# EAGLE design Jacdac_Proto_Board (EAGLE 9.6.2)
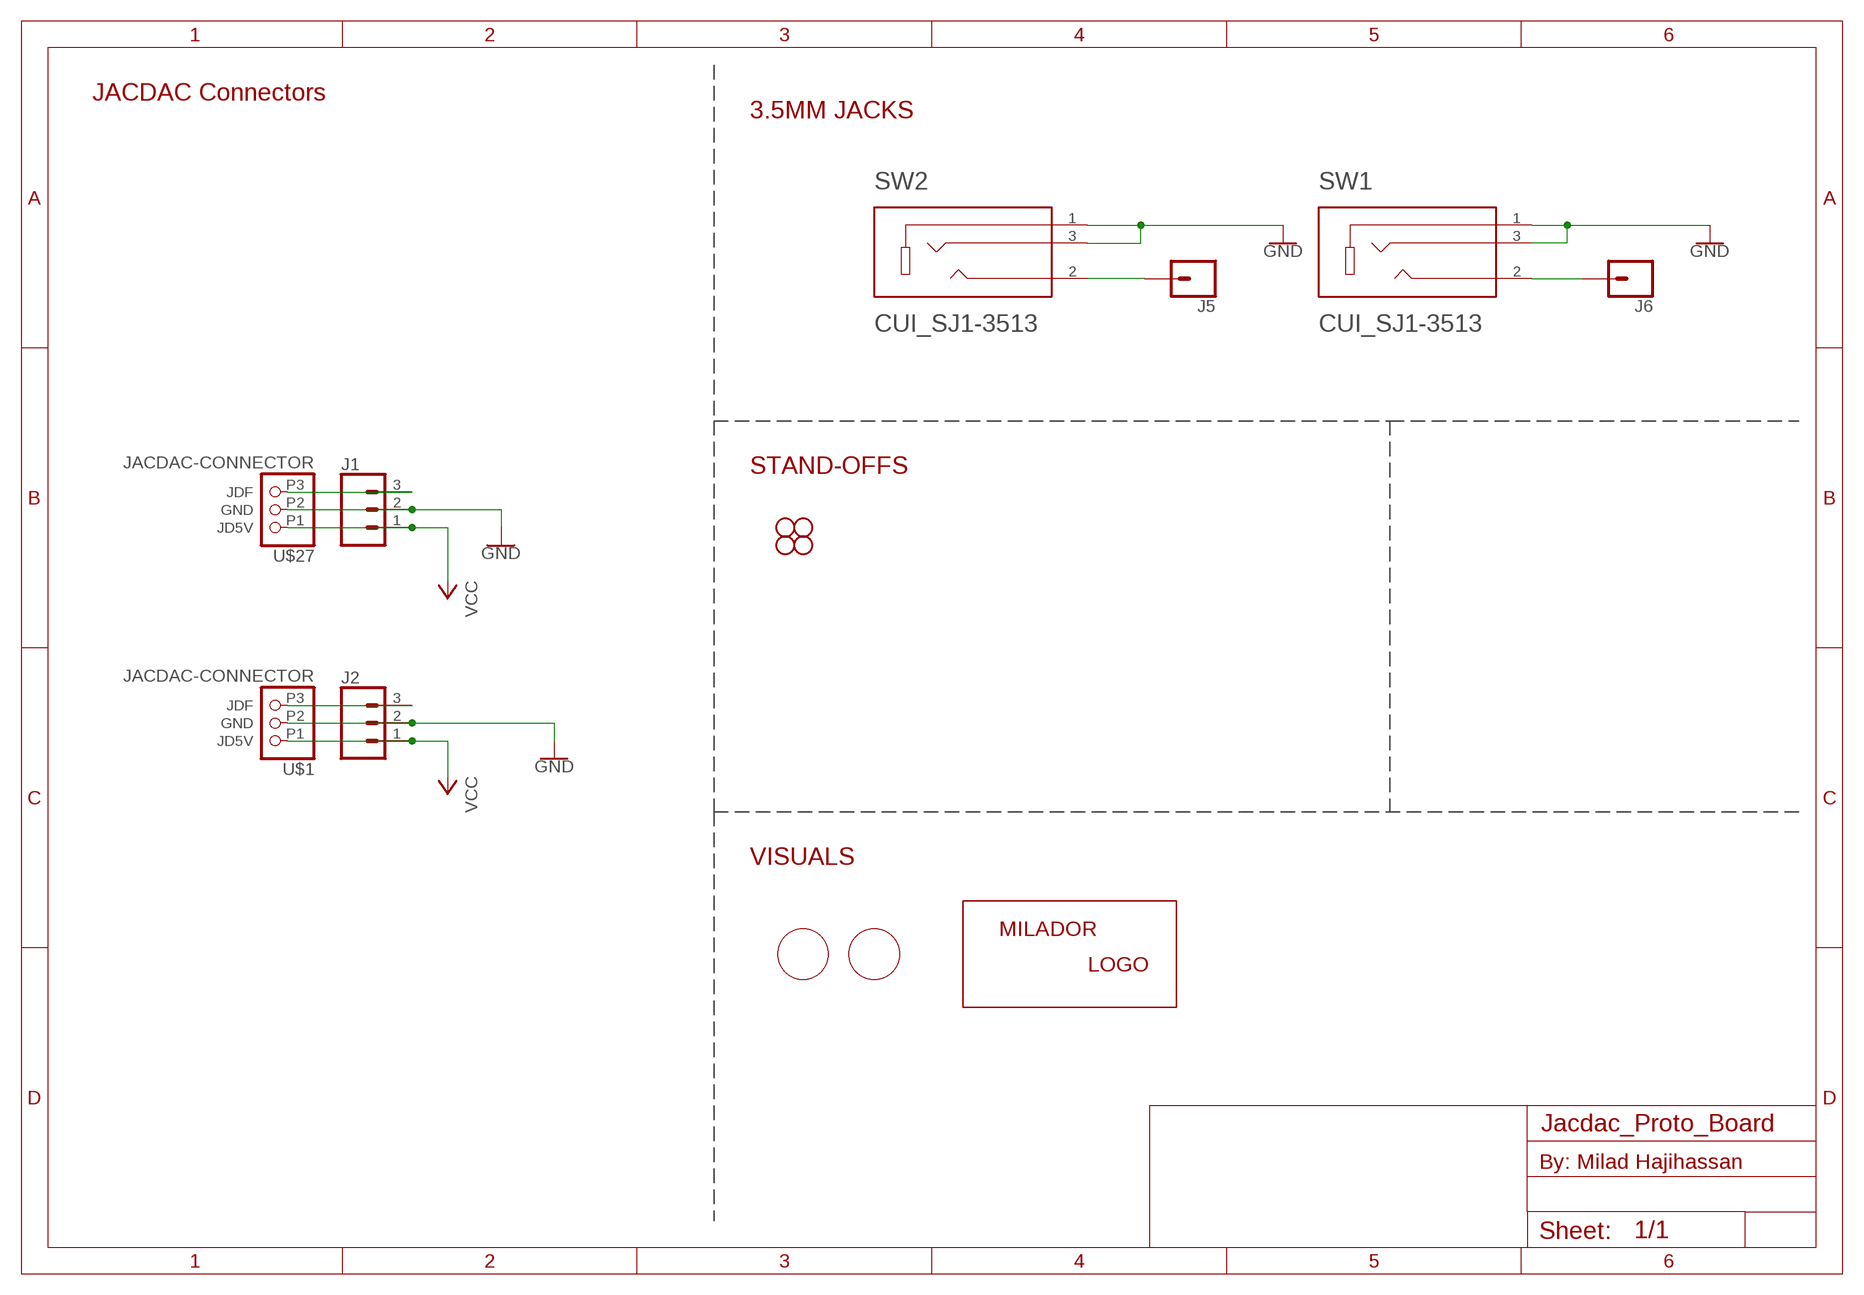
[diagram p0: schematic, sheet 1]

## Parts
H1  STAND-OFF  [STAND-OFF]
H2  STAND-OFF  [STAND-OFF]
J1  CONNECTORS_CONN_03PTH  [CONNECTORS_1X03]
J2  CONNECTORS_CONN_03PTH  [CONNECTORS_1X03]
J5  CONNECTORS_CONN_01PTH_NO_SILK_YES_STOP  [CONNECTORS_1X01_NO_SILK]
J6  CONNECTORS_CONN_01PTH_NO_SILK_YES_STOP  [CONNECTORS_1X01_NO_SILK]
JP3  STAND-OFF  [STAND-OFF]
JP4  STAND-OFF  [STAND-OFF]
SW1  CUI_SJ1-3513  [CUI_SJ1-3513]
SW2  CUI_SJ1-3513  [CUI_SJ1-3513]
U$1  JACDAC-CONNECTOR  [JACDAC-CONNECTOR]
U$2  MILADOR-LOGO-  [MILADOR_LOGO1]
U$17  MILADOR-SWITCH-NAME-SW1  [SWITCH-SW1]
U$18  MILADOR-SWITCH-NAME-SW2  [SWITCH-SW2]
U$27  JACDAC-CONNECTOR  [JACDAC-CONNECTOR]

## Nets
GND: J1.2 J2.2 SW1.1 SW1.3 SW2.1 SW2.3 U$1.P2(GND) U$27.P2(GND)
N$14: J6.1 SW1.2
N$16: J5.1 SW2.2
N$17: J1.3 U$27.P3(JDF)
N$18: J2.3 U$1.P3(JDF)
VCC: J1.1 J2.1 U$1.P1(JD5V) U$27.P1(JD5V)

## Notes on the sheet
- JACDAC Connectors
- 3.5MM JACKS
- STAND-OFFS
- VISUALS
- By: Milad Hajihassan

## Library data of the parts
H1 H2 = SparkFun-Hardware:STAND-OFF: Stand Off
J1 J2 = milador:CONNECTORS_CONN_03: Multi connection point. Often used as Generic Header-pin footprint for 0.1 inch spaced/style header connections On any of the 0.1 inch spaced packages, you can populate with these: Break Away Headers - Straight <https://www.sparkfun.com/products/116> (PRT-00116) Break Away Male Headers - Right Angle <https://www.sparkfun.com/products/553> (PRT-00553) Female Headers <https://www.sparkfun.com/products/115> (PRT-00115) Break Away Headers - Machine Pin <https://www.sparkfun.com/products/117> (PRT-00117) Break Away Female Headers - Swiss Machine Pin <https://www.sparkfun.com/products/743> (PRT-00743) For SCREWTERMINALS and SPRING TERMINALS visit here: Screw Terimnals on SparkFun.com <https://www.sparkfun.com/search/results?term=Screw+Terminals> (5mm/3.5mm/2.54mm spacing) This device is also useful as a general connection point to wire up your design to another part of your project. Our various solder wires solder well into these plated through hole pads. Hook-Up Wire - Assortment (Stranded, 22 AWG) <https://www.sparkfun.com/products/11375> (PRT-11375) Hook-Up Wire - Assortment (Solid Core, 22 AWG) <https://www.sparkfun.com/products/11367> (PRT-11367) View the entire wire category on our website here <https://www.sparkfun.com/categories/141> Special notes: Molex polarized connector foot print use with SKU : PRT-08231 with associated crimp pins and housings. 1MM SMD Version SKU: PRT-10208
J5 J6 = milador:CONNECTORS_CONN_01: Single connection point. Often used as Generic Header-pin footprint for 0.1 inch spaced/style header connections On any of the 0.1 inch spaced packages, you can populate with these: Break Away Headers - Straight <https://www.sparkfun.com/products/116> (PRT-00116) Break Away Male Headers - Right Angle <https://www.sparkfun.com/products/553> (PRT-00553) Female Headers <https://www.sparkfun.com/products/115> (PRT-00115) Break Away Headers - Machine Pin <https://www.sparkfun.com/products/117> (PRT-00117) Break Away Female Headers - Swiss Machine Pin <https://www.sparkfun.com/products/743> (PRT-00743) This device is also useful as a general connection point to wire up your design to another part of your project. Our various solder wires solder well into these plated through hole pads. Hook-Up Wire - Assortment (Stranded, 22 AWG) <https://www.sparkfun.com/products/11375> (PRT-11375) Hook-Up Wire - Assortment (Solid Core, 22 AWG) <https://www.sparkfun.com/products/11367> (PRT-11367) View the entire wire category on our website here <https://www.sparkfun.com/categories/141> Special notes: SMTSO-256-ET is a "flush mount" nut for a 4-40 screw. We mostly use this on specialty testbeds; it is a nice way to connect hardware to your PCB at an adjustable hieght. Also note, the SNAP packages are for using a snappable style connector. We sell a baggie of snaps and they are also used on two LilyPad designs: Snap Assortment - 30 pack (male and female) <https://www.sparkfun.com/products/11347> (DEV-11347) LilyPad Arduino SimpleSnap <https://www.sparkfun.com/products/10941> (DEV-10941) LilyPad SimpleSnap Protoboard <https://www.sparkfun.com/products/10940> (DEV-10940)
JP3 JP4 = SparkFun:STAND-OFF: Stand Off
SW1 SW2 = MMC Eagle:CUI_SJ1-3513
U$1 U$27 = milador:JACDAC-CONNECTOR
U$2 = milador:MILADOR-LOGO-
U$17 U$18 = milador:MILADOR-SWITCH-NAME-

## Board
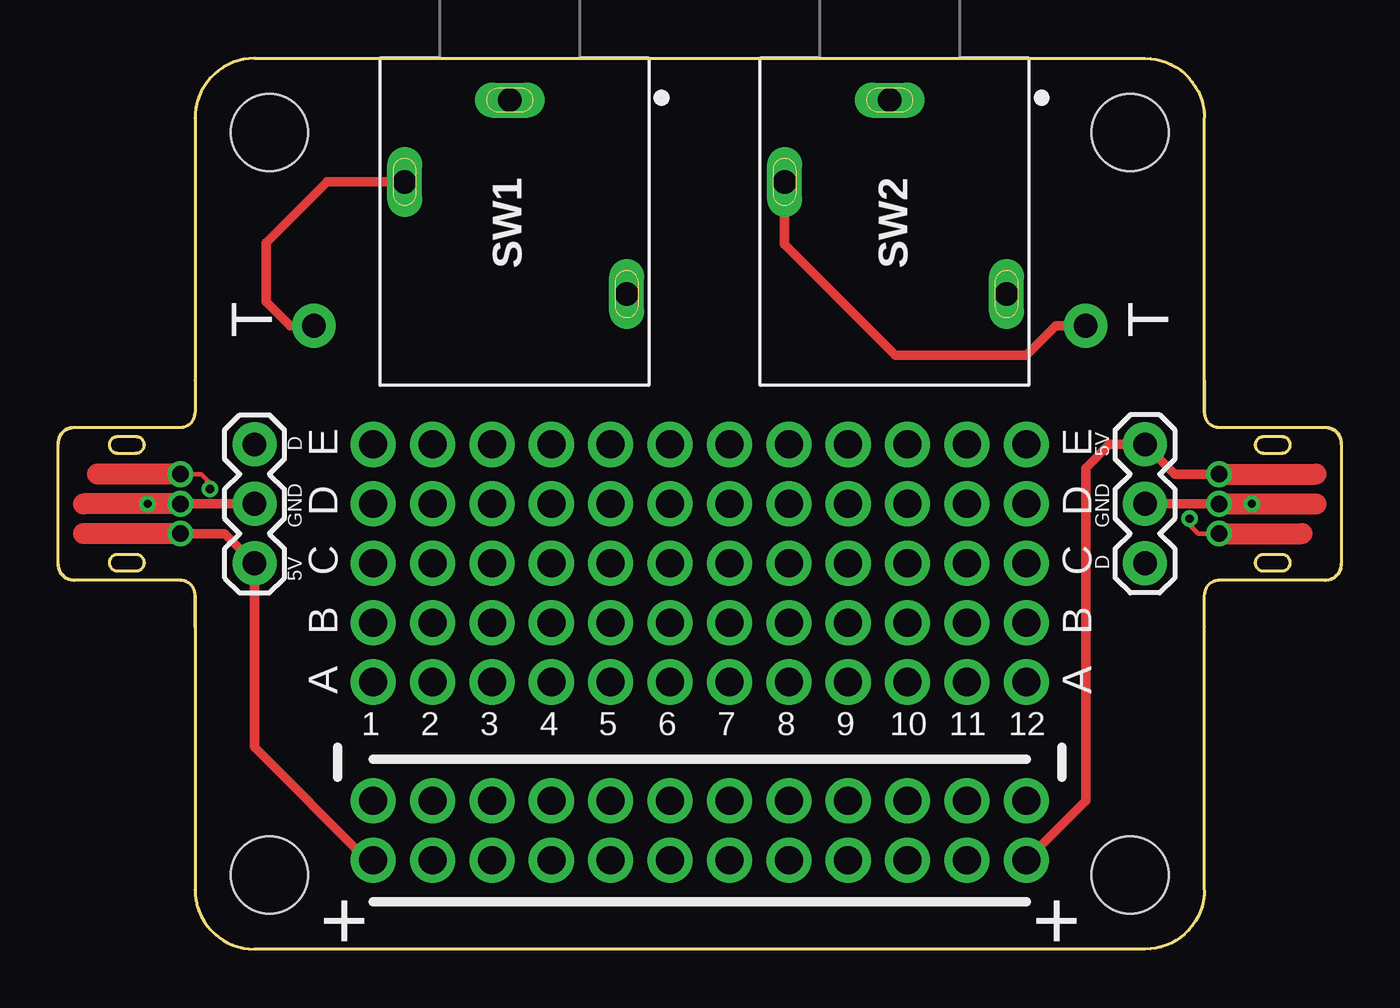
[diagram p1: board, top side]
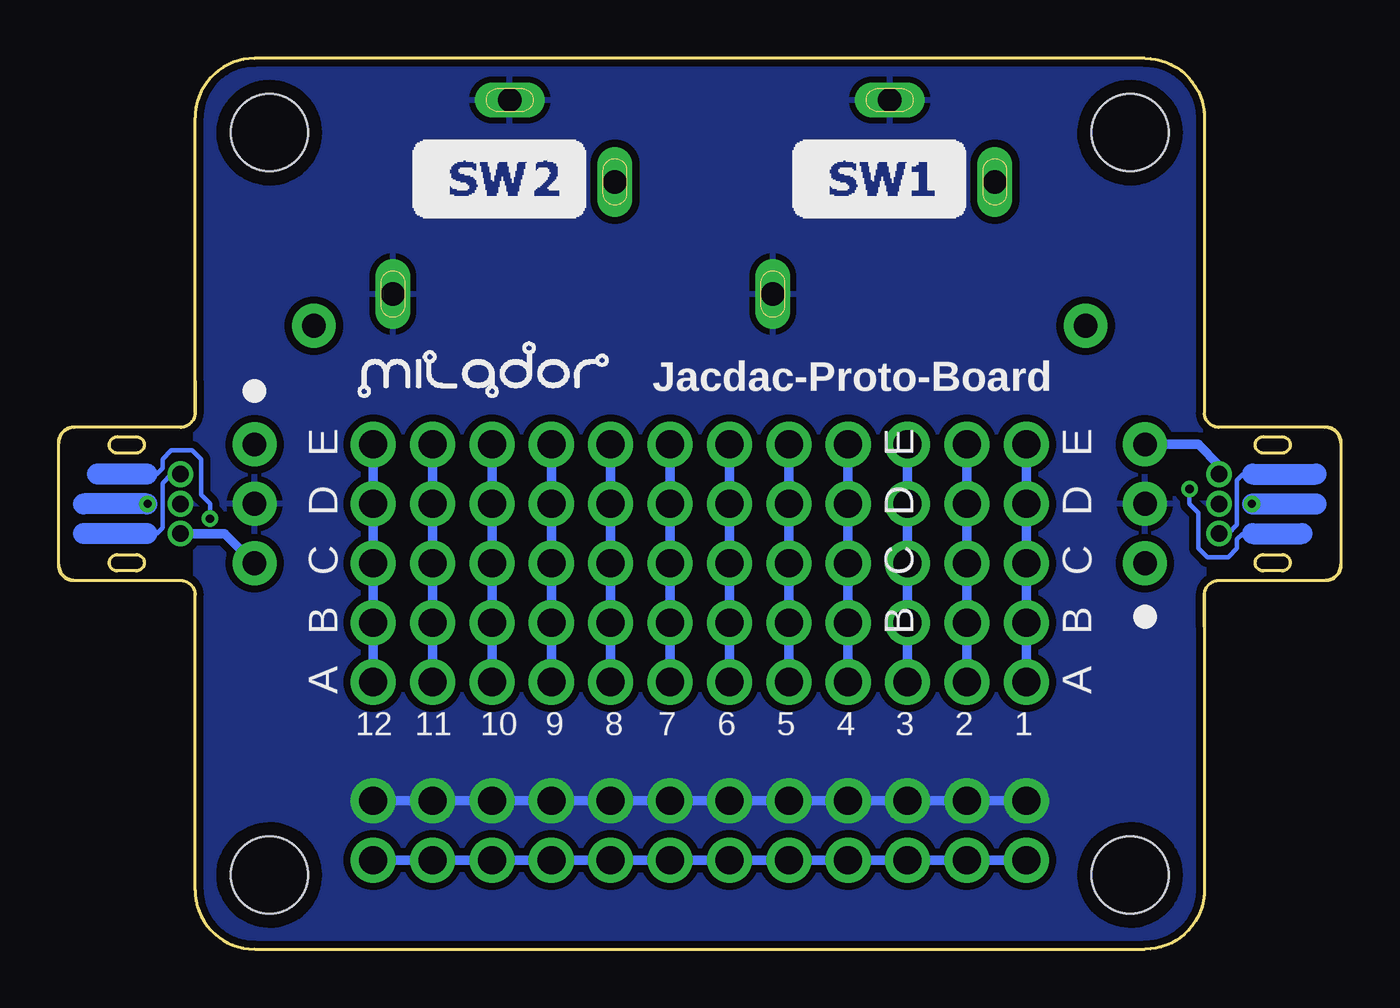
[diagram p2: board, bottom side, seen from below]

Size 54.88 x 38.1 mm. Coordinates in mm from the lower left corner, seen from the top.
Outline: 8.39,38.1 46.49,38.1 arc-90 49.03,35.56 49.03,22.95 arc90 49.66,22.32 54.25,22.32 arc-90 54.88,21.68 54.88,16.41 arc-90 54.25,15.78 49.66,15.78 arc90 49.03,15.14 49.03,2.54 arc-90 46.49,0 8.39,0 arc-90 5.85,2.54 5.85,15.14 arc90 5.21,15.78 0.63,15.78 arc-90 0,16.41 0,21.68 arc-90 0.63,22.32 5.21,22.32 arc90 5.85,22.95 5.85,35.56 arc-90 8.39,38.1
Outline: 2.17,21.57 arc90 2.52,21.22 3.32,21.22 arc90 3.67,21.57 arc90 3.32,21.92 2.52,21.92 arc90 2.17,21.57
Outline: 2.17,16.53 arc90 2.52,16.18 3.32,16.18 arc90 3.67,16.53 arc90 3.32,16.88 2.52,16.88 arc90 2.17,16.53
Outline: 52.7,16.53 arc90 52.36,16.88 51.55,16.88 arc90 51.2,16.53 arc90 51.55,16.18 52.36,16.18 arc90 52.7,16.53
Outline: 52.7,21.57 arc90 52.36,21.92 51.55,21.92 arc90 51.2,21.57 arc90 51.55,21.22 52.36,21.22 arc90 52.7,21.57
Copper layers (1*16): Top 0.035mm / dielectric 1.5mm / Bottom 0.035mm
Design rules "SparkFun-2-layer-TIGHT *": minimum track width 7mil, minimum drill 15mil, track to track 1mil, track to pad 1mil, pad to pad 1mil, via to via 1mil, smd to smd 1mil, copper to edge 7mil, drill to drill 7mil, minimum pad ring 7mil, minimum via ring 7mil, stop-mask expansion 4mil, vias tented up to drill 25mil, thermal gap 10mil

### Footprints (pad centres in the part's own frame; a part is rotated, then mirrored left to right if it is on the bottom)
STAND-OFF = hole 3.302: 0,0
CONNECTORS_1X03 = drill 1.016 pad 1.88: 1 0,0; 2 2.54,0; 3 5.08,0
CONNECTORS_1X01_NO_SILK = drill 1.016 pad 1.88: 1 0,0
CUI_SJ1-3513 = drill 1 long: 1 0,0; 2 3.5,-4.5; 3 8.3,5
JACDAC-CONNECTOR = drill 0.71 pad 1.1: P1 -1.27,0.625; P2 0,0.625; P3 1.27,0.625 | drill 0.35 pad 0.61: P$1 0,2.032; P$2 0.635,-0.635

### Placement (x,y rotation side)
H1  45.86,34.92 0 top
H2  9.02,34.92 0 top
J1  8.39,16.51 90 top
J2  46.49,21.59 270 top
J5  43.95,26.67 0 top
J6  10.93,26.67 0 top
JP3  9.02,3.17 0 top
JP4  45.86,3.17 0 top
SW1  19.31,36.32 270 top
SW2  35.57,36.32 270 top
U$1  49.03,19.05 270 top
U$2  36.58,23.62 0 bottom
U$17  19.76,32.94 0 bottom
U$18  36.01,32.94 0 bottom
U$27  5.85,19.05 90 top

### Tracks (layer width: path | path; a pad name or v marks a point on that pad's centre or on a via)
GND  (via drill 1.2 pad 1.93)
  Top 0.406: U$27.P2 J1.2 | U$1.P2 J2.2
  Bottom 0.406: v13.47,6.35 v16.01,6.35 v18.55,6.35 v21.09,6.35 v23.63,6.35 v26.17,6.35 v28.71,6.35 v31.25,6.35 v33.79,6.35 v36.33,6.35 v38.87,6.35 v41.41,6.35
  pour Bottom (isolate 0.305): 49.03,38.1 49.03,0 5.85,0 5.85,38.1
N$1  (via drill 1.2 pad 1.93)
  Bottom 0.406: v13.47,21.59 v13.47,19.05 v13.47,16.51 v13.47,13.97 v13.47,11.43
N$2  (via drill 1.2 pad 1.93)
  Bottom 0.406: v16.01,11.43 v16.01,13.97 v16.01,16.51 v16.01,19.05 v16.01,21.59
N$3  (via drill 1.2 pad 1.93)
  Bottom 0.406: v18.55,21.59 v18.55,19.05 v18.55,16.51 v18.55,13.97 v18.55,11.43
N$4  (via drill 1.2 pad 1.93)
  Bottom 0.406: v21.09,11.43 v21.09,13.97 v21.09,16.51 v21.09,19.05 v21.09,21.59
N$5  (via drill 1.2 pad 1.93)
  Bottom 0.406: v23.63,21.59 v23.63,19.05 v23.63,16.51 v23.63,13.97 v23.63,11.43
N$6  (via drill 1.2 pad 1.93)
  Bottom 0.406: v26.17,11.43 v26.17,13.97 v26.17,16.51 v26.17,19.05 v26.17,21.59
N$7  (via drill 1.2 pad 1.93)
  Bottom 0.406: v31.25,11.43 v31.25,13.97 v31.25,16.51 v31.25,19.05 v31.25,21.59
N$8  (via drill 1.2 pad 1.93)
  Bottom 0.406: v28.71,21.59 v28.71,19.05 v28.71,16.51 v28.71,13.97 v28.71,11.43
N$9  (via drill 1.2 pad 1.93)
  Bottom 0.406: v33.79,21.59 v33.79,19.05 v33.79,16.51 v33.79,13.97 v33.79,11.43
N$10  (via drill 1.2 pad 1.93)
  Bottom 0.406: v36.33,21.59 v36.33,19.05 v36.33,16.51 v36.33,13.97 v36.33,11.43
N$11  (via drill 1.2 pad 1.93)
  Bottom 0.406: v38.87,21.59 v38.87,19.05 v38.87,16.51 v38.87,13.97 v38.87,11.43
N$12  (via drill 1.2 pad 1.93)
  Bottom 0.406: v41.41,11.43 v41.41,13.97 v41.41,16.51 v41.41,19.05 v41.41,21.59
N$14
  Top 0.406: SW1.2 11.49,32.82 8.9,30.23 8.9,27.69 9.91,26.67 J6.1
N$16
  Top 0.406: J5.1 42.68,26.67 41.41,25.4 35.82,25.4 31.07,30.15 SW2.2
N$17
  Bottom 0.406: U$27.P3 5.22,20.71 6.1,21.59 J1.3
N$18
  Bottom 0.406: J2.3 47.76,17.78 U$1.P3
VCC  (via drill 1.2 pad 1.93)
  Top 0.406: U$27.P1 7.12,17.78 J1.1 8.39,8.64 13.22,3.81 v13.47,3.81 | U$1.P1 47.76,20.32 J2.1 44.97,21.59 43.95,20.57 43.95,6.35 v41.41,3.81
  Bottom 0.406: v13.47,3.81 v16.01,3.81 v18.55,3.81 v21.09,3.81 v23.63,3.81 v26.17,3.81 v28.71,3.81 v31.25,3.81 v33.79,3.81 v36.33,3.81 v38.87,3.81 v41.41,3.81

### Text on the board
tPlace: T | T | D | E | E | 5V | D | D | GND | GND | 5V | C | C | D | B | B | A | A | 1 | 2 | 3 | 4 | 5 | 6 | 7 | 8 | 9 | 10 | 11 | 12 | + | +
bPlace: Jacdac-Proto-Board | E | E | E | D | D | D | C | C | C | B | B | B | A | A | 1 | 2 | 3 | 4 | 5 | 6 | 7 | 8 | 9 | 10 | 11 | 12